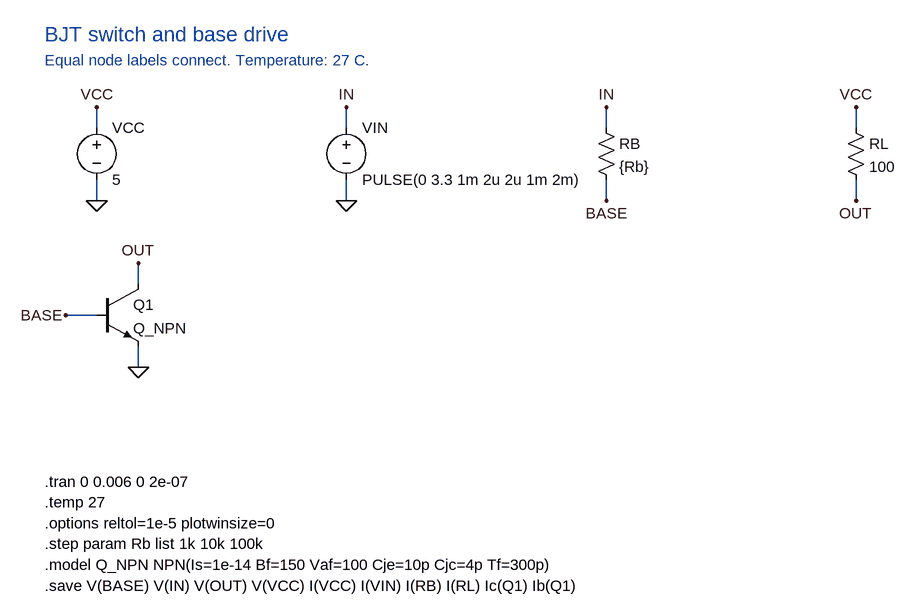
[diagram p0: schematic bjt-switch.asc]
bjt-switch.asc, the LTspice schematic file:
Version 4
SHEET 1 1740 1032
WIRE 144 176 144 144
WIRE 144 256 144 288
WIRE 528 176 528 144
WIRE 528 256 528 288
WIRE 928 176 928 144
WIRE 928 256 928 288
WIRE 1312 176 1312 144
WIRE 1312 256 1312 288
WIRE 208 416 208 384
WIRE 144 464 96 464
WIRE 208 512 208 544
FLAG 144 144 VCC
FLAG 144 288 0
FLAG 528 144 IN
FLAG 528 288 0
FLAG 928 144 IN
FLAG 928 288 BASE
FLAG 1312 144 VCC
FLAG 1312 288 OUT
FLAG 208 384 OUT
FLAG 96 464 BASE
FLAG 208 544 0
SYMBOL voltage 144 160 R0
SYMATTR InstName VCC
SYMATTR Value 5
SYMBOL voltage 528 160 R0
SYMATTR InstName VIN
SYMATTR Value PULSE(0 3.3 1m 2u 2u 1m 2m)
SYMBOL res 912 160 R0
SYMATTR InstName RB
SYMATTR Value {Rb}
SYMBOL res 1296 160 R0
SYMATTR InstName RL
SYMATTR Value 100
SYMBOL npn 144 416 R0
SYMATTR InstName Q1
SYMATTR Value Q_NPN
TEXT 64 32 Left 3 ;BJT switch and base drive
TEXT 64 72 Left 2 ;Equal node labels connect. Temperature: 27 C.
TEXT 64 720 Left 2 !.tran 0 0.006 0 2e-07
TEXT 64 752 Left 2 !.temp 27
TEXT 64 784 Left 2 !.options reltol=1e-5 plotwinsize=0
TEXT 64 816 Left 2 !.step param Rb list 1k 10k 100k
TEXT 64 848 Left 2 !.model Q_NPN NPN(Is=1e-14 Bf=150 Vaf=100 Cje=10p Cjc=4p Tf=300p)
TEXT 64 880 Left 2 !.save V(BASE) V(IN) V(OUT) V(VCC) I(VCC) I(VIN) I(RB) I(RL) Ic(Q1) Ib(Q1)

The netlist it stands for:
* bjt-switch.asc
VCC VCC 0 5
VIN IN 0 PULSE(0 3.3 1m 2u 2u 1m 2m)
RB IN BASE {Rb}
RL VCC OUT 100
Q1 OUT BASE 0 0 Q_NPN
.model NPN NPN
.model PNP PNP
.lib standard.bjt
* BJT switch and base drive
* Equal node labels connect. Temperature: 27 C.
.tran 0 0.006 0 2e-07
.temp 27
.options reltol=1e-5 plotwinsize=0
.step param Rb list 1k 10k 100k
.model Q_NPN NPN(Is=1e-14 Bf=150 Vaf=100 Cje=10p Cjc=4p Tf=300p)
.save V(BASE) V(IN) V(OUT) V(VCC) I(VCC) I(VIN) I(RB) I(RL) Ic(Q1) Ib(Q1)
.backanno
.end